# Altium schematic sheet XTAG4.SchDoc: xcore.ai Multi Channel Audio
size 584 x 408 mm; DocumentNumber: 7; Revision: 1V1; SheetNumber: 7; SheetTotal: 8
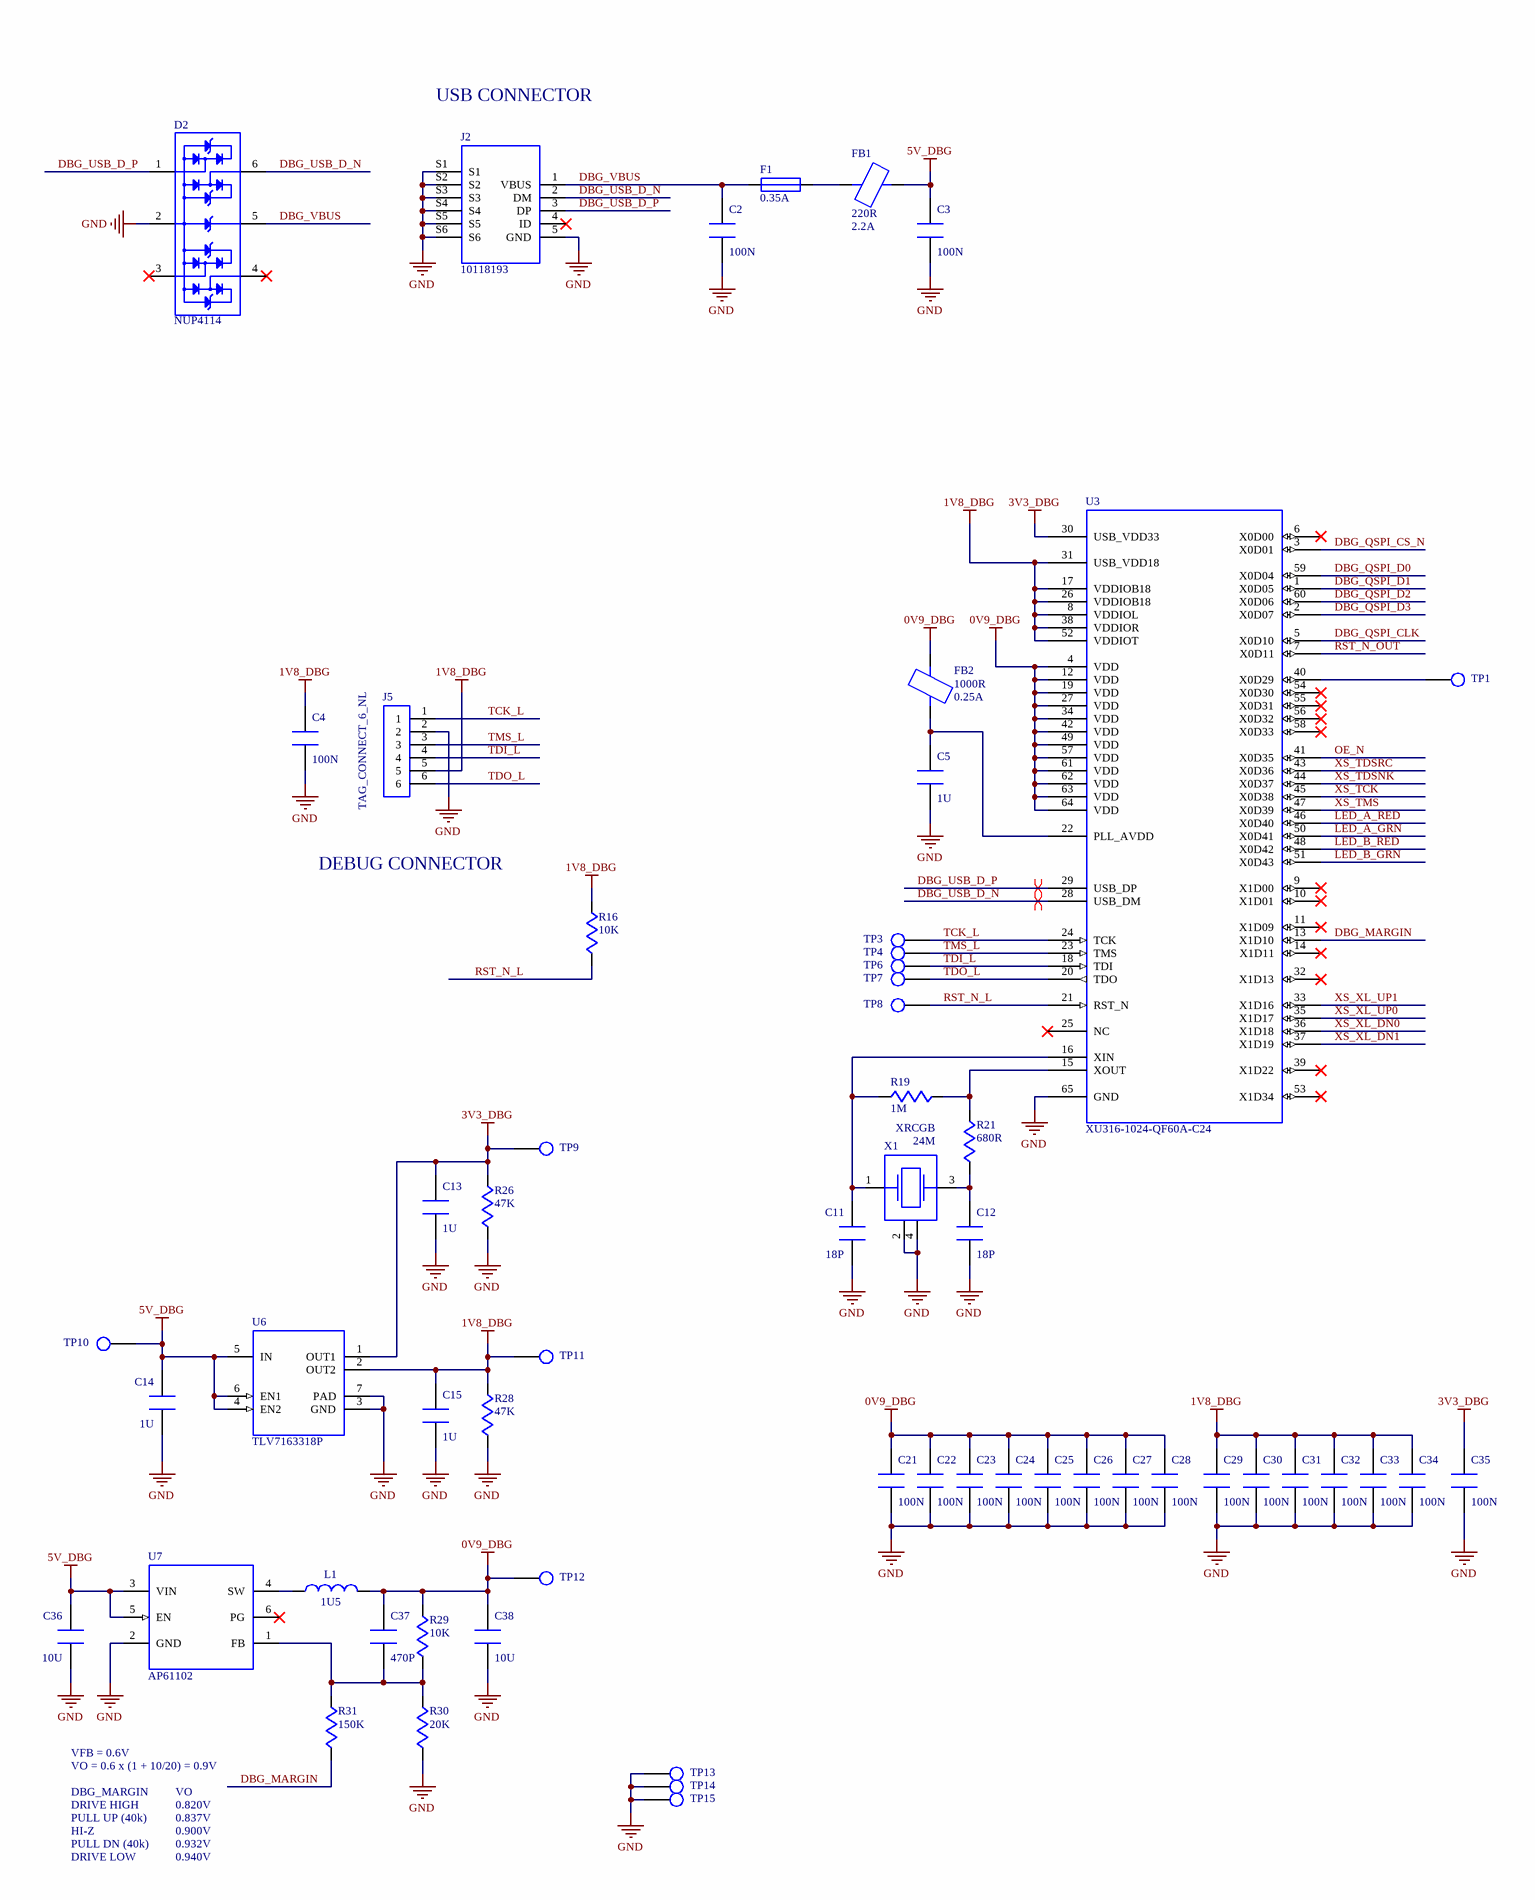
[diagram p0: XTAG4.SchDoc, left]
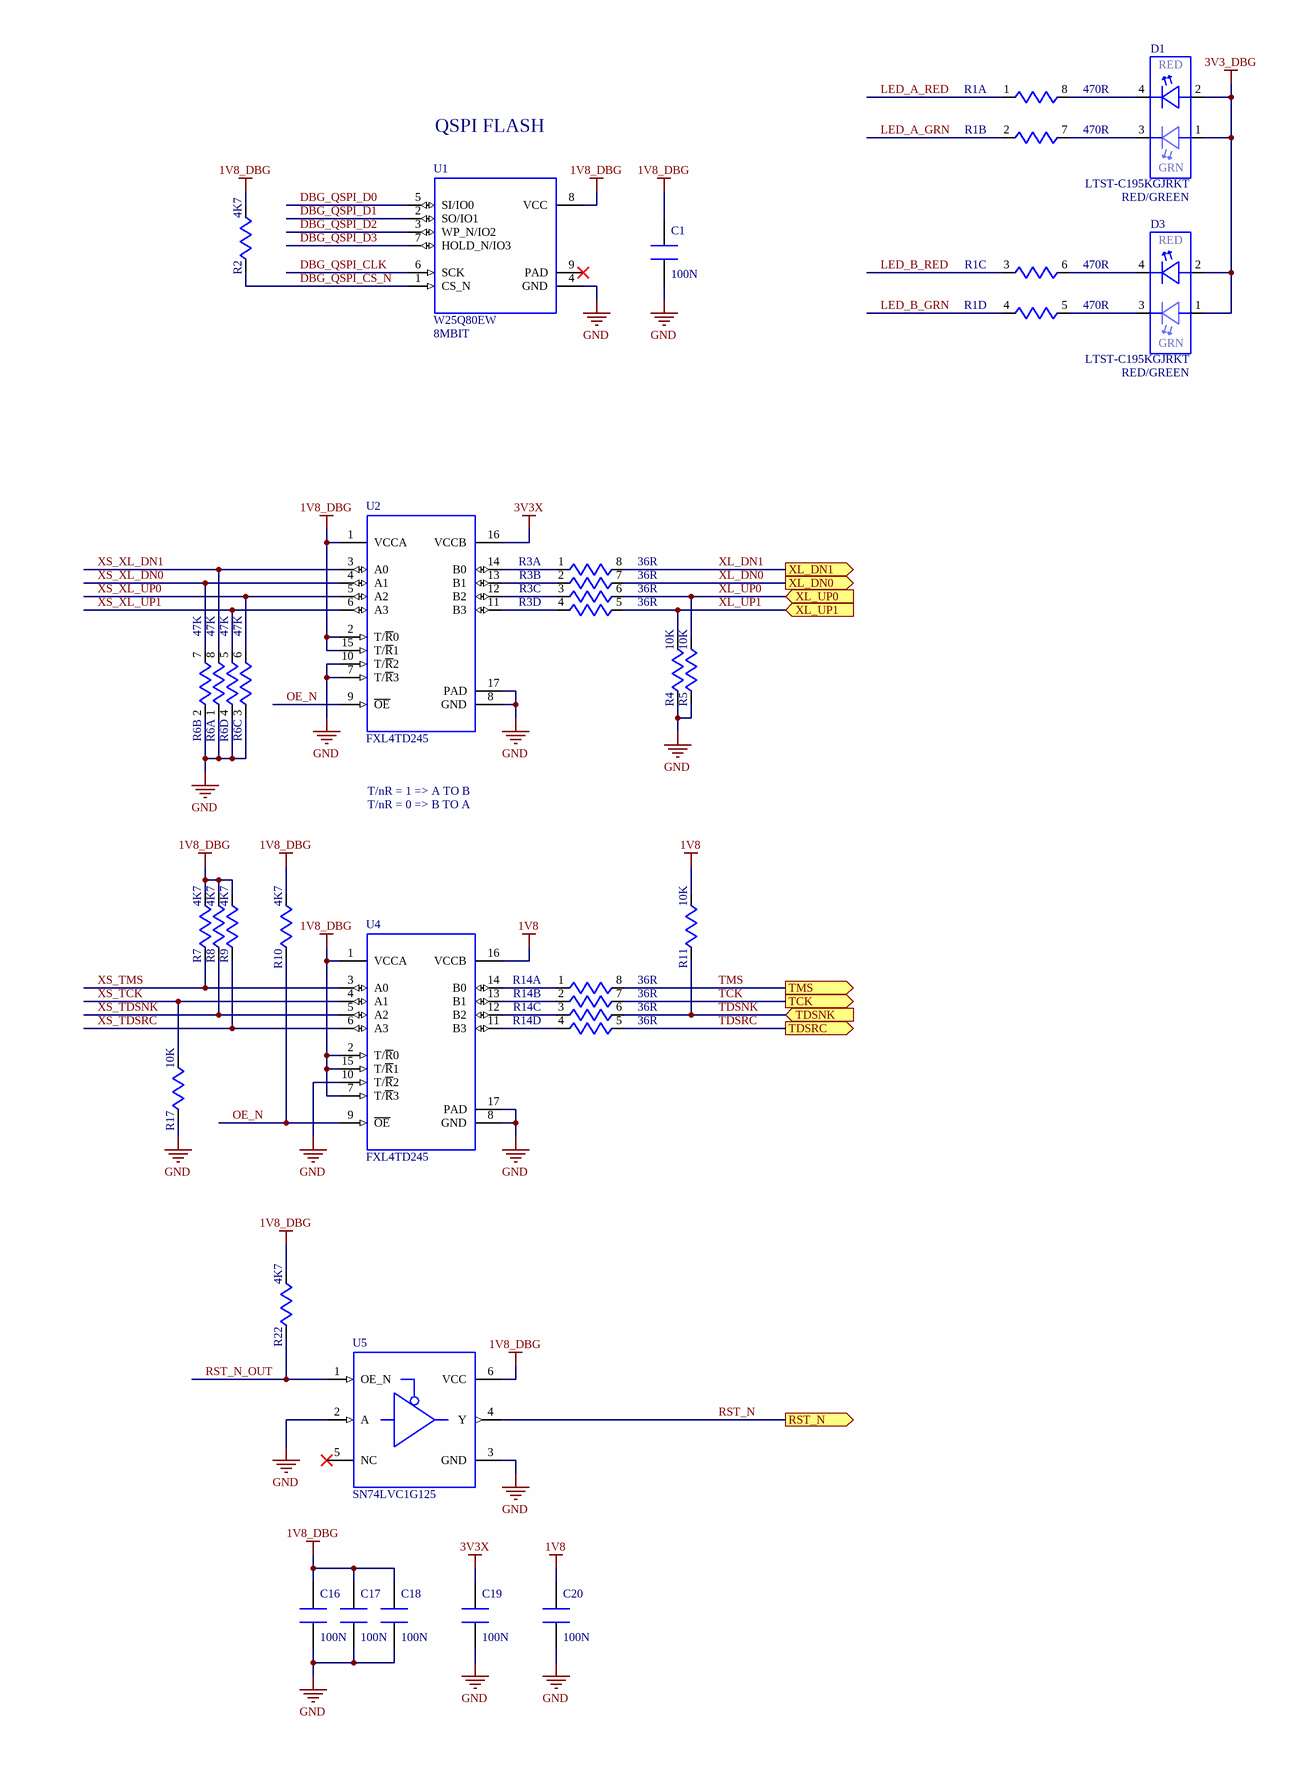
[diagram p1: XTAG4.SchDoc, right]

## Parts
C1  100N  [CAPC1005X55N]
C2  100N  [CAPC1005X55N]
C3  100N  [CAPC1005X55N]
C4  100N  [CAPC1005X55N]
C5  1U  [CAPC1005X55N]
C11  18P  [CAPC1005X55N]
C12  18P  [CAPC1005X55N]
C13  1U  [CAPC1005X55N]
C14  1U  [CAPC1005X55N]
C15  1U  [CAPC1005X55N]
C16  100N  [CAPC1005X55N]
C17  100N  [CAPC1005X55N]
C18  100N  [CAPC1005X55N]
C19  100N  [CAPC1005X55N]
C20  100N  [CAPC1005X55N]
C21  100N  [CAPC1005X55N]
C22  100N  [CAPC1005X55N]
C23  100N  [CAPC1005X55N]
C24  100N  [CAPC1005X55N]
C25  100N  [CAPC1005X55N]
C26  100N  [CAPC1005X55N]
C27  100N  [CAPC1005X55N]
C28  100N  [CAPC1005X55N]
C29  100N  [CAPC1005X55N]
C30  100N  [CAPC1005X55N]
C31  100N  [CAPC1005X55N]
C32  100N  [CAPC1005X55N]
C33  100N  [CAPC1005X55N]
C34  100N  [CAPC1005X55N]
C35  100N  [CAPC1005X55N]
C36  10U  [CAPC1608X90N]
C37  470P  [CAPC1005X55N]
C38  10U  [CAPC1608X90N]
D1  LTST-C195KGJRKT  Colour: RED/GREEN  [LED_LITEON_LTST_C195KGJRKT]
D2  NUP4114  [SOT65P210X110-6N]
D3  LTST-C195KGJRKT  Colour: RED/GREEN  [LED_LITEON_LTST_C195KGJRKT]
F1  0.35A  [FUSC215X135X75L40N]
FB1  220R  Rated Current: 2.2A  [INDC1608X95N]
FB2  1000R  Rated Current: 0.25A  [INDC1005X55N]
J2  10118193  [CON_FCI_10118193]
J5  TAG_CONNECT_6_NL  [CON_TAG_CONNECT_6_NOLEG]  (no BOM)
L1  1U5  [INDC2520X120N]
R1  470R  [RESCAXS50P200X100X55-8N]  (parts A,B,C,D of 4)
R2  4K7  [RESC1005X40N]
R3  36R  [RESCAXS50P200X100X55-8N]  (parts A,B,C,D of 4)
R4  10K  [RESC1005X40N]
R5  10K  [RESC1005X40N]
R6  47K  [RESCAXS50P200X100X55-8N]  (parts A,B,C,D of 4)
R7  4K7  [RESC1005X40N]
R8  4K7  [RESC1005X40N]
R9  4K7  [RESC1005X40N]
R10  4K7  [RESC1005X40N]
R11  10K  [RESC1005X40N]
R14  36R  [RESCAXS50P200X100X55-8N]  (parts A,B,C,D of 4)
R16  10K  [RESC1005X40N]
R17  10K  [RESC1005X40N]
R19  1M  [RESC1005X40N]
R21  680R  [RESC1005X40N]
R22  4K7  [RESC1005X40N]
R26  47K  [RESC1005X40N]
R28  47K  [RESC1005X40N]
R29  10K  [RESC1005X40N]
R30  20K  [RESC1005X40N]
R31  150K  [RESC1005X40N]
TP1  TESTPOINT  [TESTPOINT_SMD_1MM]  (value not drawn)  (no BOM)
TP3  TESTPOINT  [TESTPOINT_SMD_1.2MM]  (value not drawn)  (no BOM)
TP4  TESTPOINT  [TESTPOINT_SMD_1.2MM]  (value not drawn)  (no BOM)
TP6  TESTPOINT  [TESTPOINT_SMD_1.2MM]  (value not drawn)  (no BOM)
TP7  TESTPOINT  [TESTPOINT_SMD_1.2MM]  (value not drawn)  (no BOM)
TP8  TESTPOINT  [TESTPOINT_SMD_1.2MM]  (value not drawn)  (no BOM)
TP9  TESTPOINT  [TESTPOINT_SMD_1.2MM]  (value not drawn)  (no BOM)
TP10  TESTPOINT  [TESTPOINT_SMD_1.2MM]  (value not drawn)  (no BOM)
TP11  TESTPOINT  [TESTPOINT_SMD_1.2MM]  (value not drawn)  (no BOM)
TP12  TESTPOINT  [TESTPOINT_SMD_1.2MM]  (value not drawn)  (no BOM)
TP13  TESTPOINT  [TESTPOINT_SMD_1.2MM]  (value not drawn)  (no BOM)
TP14  TESTPOINT  [TESTPOINT_SMD_1.2MM]  (value not drawn)  (no BOM)
TP15  TESTPOINT  [TESTPOINT_SMD_1.2MM]  (value not drawn)  (no BOM)
U1  W25Q80EW  Memory Size: 8MBIT  [SON9P50_200X300X60L45X25T160X20N]
U2  FXL4TD245  [IC_NXP_DHVQFN16]
U3  XU316-1024-QF60A-C24  [IC_XMOS_PX_QFN60A_NEWPADDLE]
U4  FXL4TD245  [IC_NXP_DHVQFN16]
U5  SN74LVC1G125  [TI_R_PUSON_N6]
U6  TLV7163318P  [TI_S_PX2SON_N6]
U7  AP61102  [ICSOFL6P50_160X160X60L30X21N]
X1  XRCGB  FREQUENCY: 24M  [OSCCC200X160X70N]

## Ports
RST_N (out), TCK (out), TDSNK (in), TDSRC (out), TMS (out), XL_DN0 (out), XL_DN1 (out), XL_UP0 (in), XL_UP1 (in)

## Nets
0V9_DBG: C21.1 C22.1 C23.1 C24.1 C25.1 C26.1 C27.1 C28.1 C37.1 C38.1 FB2.2 L1.2 R29.2 TP12.1 U3.4(VDD) U3.12(VDD) U3.19(VDD) U3.27(VDD) U3.34(VDD) U3.42(VDD) U3.49(VDD) U3.57(VDD) U3.61(VDD) U3.62(VDD) U3.63(VDD) U3.64(VDD)
1V8: C20.1 R11.2 U4.16(VCCB)
1V8_DBG: C1.1 C4.1 C15.1 C16.1 C17.1 C18.1 C29.1 C30.1 C31.1 C32.1 C33.1 C34.1 J5.5 R2.2 R7.2 R8.2 R9.2 R10.2 R16.2 R22.2 R28.2 TP11.1 U1.8(VCC) U2.1(VCCA) U2.2(T/~{R}0) U2.15(T/~{R}1) U3.8(VDDIOL) U3.17(VDDIOB18) U3.26(VDDIOB18) U3.31(USB_VDD18) U3.38(VDDIOR) U3.52(VDDIOT) U4.1(VCCA) U4.2(T/~{R}0) U4.7(T/~{R}3) U4.15(T/~{R}1) U5.6(VCC) U6.2(OUT2)
3V3_DBG: C13.1 C35.1 D1.1(GRN_A) D1.2(RED_A) D3.1(GRN_A) D3.2(RED_A) R26.2 TP9.1 U3.30(USB_VDD33) U6.1(OUT1)
3V3X: C19.1 U2.16(VCCB)
5V_DBG: C3.1 C14.1 C36.1 FB1.2 TP10.1 U6.4(EN2) U6.5(IN) U6.6(EN1) U7.3(VIN) U7.5(EN)
GND: C1.2 C2.2 C3.2 C4.2 C5.2 C11.2 C12.2 C13.2 C14.2 C15.2 C16.2 C17.2 C18.2 C19.2 C20.2 C21.2 C22.2 C23.2 C24.2 C25.2 C26.2 C27.2 C28.2 C29.2 C30.2 C31.2 C32.2 C33.2 C34.2 C35.2 C36.2 C38.2 D2.2 J2.5(GND) J2.S1 J2.S2 J2.S3 J2.S4 J2.S5 J2.S6 J5.2 R4.1 R5.1 R6.1 R6.2 R6.3 R6.4 R17.1 R26.1 R28.1 R30.1 TP13.1 TP14.1 TP15.1 U1.4(GND) U2.7(T/~{R}3) U2.8(GND) U2.10(T/~{R}2) U2.17(PAD) U3.65(GND) U4.8(GND) U4.10(T/~{R}2) U4.17(PAD) U5.2(A) U5.3(GND) U6.3(GND) U6.7(PAD) U7.2(GND) X1.2(CASE_2) X1.4(CASE_4)
DBG_MARGIN: R31.1 U3.13(X1D10)
DBG_QSPI_CLK: U1.6(SCK) U3.5(X0D10)
DBG_QSPI_CS_N: R2.1 U1.1(CS_N) U3.3(X0D01)
DBG_QSPI_D0: U1.5(SI/IO0) U3.59(X0D04)
DBG_QSPI_D1: U1.2(SO/IO1) U3.1(X0D05)
DBG_QSPI_D2: U1.3(WP_N/IO2) U3.60(X0D06)
DBG_QSPI_D3: U1.7(HOLD_N/IO3) U3.2(X0D07)
DBG_USB_D_N: D2.6 J2.2(DM) U3.28(USB_DM)
DBG_USB_D_P: D2.1 J2.3(DP) U3.29(USB_DP)
DBG_VBUS: C2.1 D2.5 F1.1(T1) J2.1(VBUS)
LED_A_GRN: R1.2 U3.50(X0D41)
LED_A_RED: R1.1 U3.46(X0D40)
LED_B_GRN: R1.4 U3.51(X0D43)
LED_B_RED: R1.3 U3.48(X0D42)
OE_N: R10.1 U2.9(~{OE}) U3.41(X0D35) U4.9(~{OE})
RST_N: U5.4(Y) ; port RST_N
RST_N_L: R16.1 TP8.1 U3.21(RST_N)
RST_N_OUT: R22.1 U3.7(X0D11) U5.1(OE_N)
TCK: R14.7 ; port TCK
TCK_L: J5.1 TP3.1 U3.24(TCK)
TDI_L: J5.4 TP6.1 U3.18(TDI)
TDO_L: J5.6 TP7.1 U3.20(TDO)
TDSNK: R11.1 R14.6 ; port TDSNK
TDSRC: R14.5 ; port TDSRC
TMS: R14.8 ; port TMS
TMS_L: J5.3 TP4.1 U3.23(TMS)
XL_DN0: R3.7 ; port XL_DN0
XL_DN1: R3.8 ; port XL_DN1
XL_UP0: R3.6 R5.2 ; port XL_UP0
XL_UP1: R3.5 R4.2 ; port XL_UP1
XS_TCK: R17.2 U3.45(X0D38) U4.4(A1)
XS_TDSNK: R8.1 U3.44(X0D37) U4.5(A2)
XS_TDSRC: R9.1 U3.43(X0D36) U4.6(A3)
XS_TMS: R7.1 U3.47(X0D39) U4.3(A0)
XS_XL_DN0: R6.7 U2.4(A1) U3.36(X1D18)
XS_XL_DN1: R6.8 U2.3(A0) U3.37(X1D19)
XS_XL_UP0: R6.6 U2.5(A2) U3.35(X1D17)
XS_XL_UP1: R6.5 U2.6(A3) U3.33(X1D16)
NetC5_1: C5.1 FB2.1 U3.22(PLL_AVDD)
NetC11_1: C11.1 R19.1 U3.16(XIN) X1.1(A)
NetC12_1: C12.1 R21.1 X1.3(B)
NetC37_2: C37.2 R29.1 R30.2 R31.2 U7.1(FB)
NetD1_3: D1.3(GRN_K) R1.7
NetD1_4: D1.4(RED_K) R1.8
NetD3_3: D3.3(GRN_K) R1.5
NetD3_4: D3.4(RED_K) R1.6
NetF1_2: F1.2(T2) FB1.1
NetL1_1: L1.1 U7.4(SW)
NetR3_1: R3.1 U2.14(B0)
NetR3_2: R3.2 U2.13(B1)
NetR3_3: R3.3 U2.12(B2)
NetR3_4: R3.4 U2.11(B3)
NetR14_1: R14.1 U4.14(B0)
NetR14_2: R14.2 U4.13(B1)
NetR14_3: R14.3 U4.12(B2)
NetR14_4: R14.4 U4.11(B3)
NetR19_2: R19.2 R21.2 U3.15(XOUT)
NetTP1_1: TP1.1 U3.40(X0D29)

Not connected (* = marked no-connect by the designer): D2 3* 4*; J2 4(ID)*; U1 9(PAD)*; U3 6(X0D00)* 9(X1D00)* 10(X1D01)* 11(X1D09)* 14(X1D11)* 25(NC)* 32(X1D13)* 39(X1D22)* 53(X1D34)* 54(X0D30)* 55(X0D31)* 56(X0D32)* 58(X0D33)*; U5 5(NC)*; U7 6(PG)*

## Layout directives
differential pair; differential pair class USB: DBG_USB_D_N, DBG_USB_D_P

## Notes on the sheet
- USB CONNECTOR
- QSPI FLASH
- T/nR = 1 => A TO B
- T/nR = 0 => B TO A
- DEBUG CONNECTOR
- VFB = 0.6V
- VO = 0.6 x (1 + 10/20) = 0.9V
- DBG_MARGIN
- VO
- HI-Z
- PULL DN (40k)
- PULL UP (40k)
- DRIVE LOW
- DRIVE HIGH
- 0.900V
- 0.932V
- 0.837V
- 0.940V
- 0.820V
- Project Name
- Build
- Sheet Name
- Rev
- Date
- Sheet
- of
- (in symbol GEN-17-0007) RED; GRN

## Library data of the parts
C1-C4 C16-C35 = STD-06-0048: CHIP CAPACITOR, CERAMIC, 100NF, 16V, 10%, X7R, 0402; Manufacturer: Yageo; Manufacturer Part Number: CC0402KRX7R7BB104; Approx Volume Cost ($): 0.003; VALUE: 100N; Part Number: STD-06-0048; Dielectric: X7R; Rated Voltage: 16V; Tolerance: 10%
C5 C13-C15 = STD-06-0140: CHIP CAPACITOR, CERAMIC, 1.0UF, 16V, 10%, X5R, 0402; Manufacturer: Murata; Manufacturer Part Number: GRM155R61C105MA12D; Tolerance: 20%; Approx Volume Cost ($): 0.011; VALUE: 1U; Part Number: STD-06-0140; Dielectric: X5R; Rated Voltage: 16V
C11 C12 = STD-06-0016: CHIP CAPACITOR, CERAMIC, 18PF, 50V, 5%, NP0, 0402; Manufacturer: Yageo; Manufacturer Part Number: CC0402JRNPO9BN180; Approx Volume Cost ($): 0.003; VALUE: 18P; Part Number: STD-06-0016; Dielectric: NP0; Rated Voltage: 50V; Tolerance: 5%
C36 C38 = GEN-03-0043: CHIP CAPACITOR, CERAMIC, 10UF, 10V, 20%, X5R, 0603; Manufacturer: Murata; Manufacturer Part Number: GRM188R61A106ME69; Approx Volume Cost ($): 0.03; VALUE: 10U; Part Number: GEN-03-0043; Dielectric: X5R; Rated Voltage: 10V; Tolerance: 20%
C37 = STD-06-0034: CHIP CAPACITOR, CERAMIC, 470PF, 50V, 10%, X7R, 0402; Manufacturer: Yageo; Manufacturer Part Number: CC0402KRX7R9BB471; Approx Volume Cost ($): 0.002; VALUE: 470P; Part Number: STD-06-0034; Dielectric: X7R; Rated Voltage: 50V; Tolerance: 10%; Web Search Link: http://www.google.com/search?q=CC0402KRX7R9BB471
D1 D3 = GEN-17-0007: LED, Top View, RED/GREEN, SMD, 0606; Manufacturer: Lite-On; Approx Volume Cost ($): 0.1; VALUE: LTST-C195KGJRKT; Part Number: GEN-17-0007; Manufacturer Part Number: LTST-C195KGJRKT
D2 = GEN-16-0048: ESD Protection Diode Array, 0.6pF, SC-70-6 (SC-88); Manufacturer: ON Semiconductor; Manufacturer Part Number: NUP4114UCLW1T2G; Approx Volume Cost ($): 0.1; VALUE: NUP4114; Part Number: GEN-16-0048; Web Search Link: http://www.google.com/search?q=NUP4114UCLW1T2G
F1 = GEN-21-0009: PTC Fuse, SMD, 0.35A hold, 0.75A trip, 6V, 0805; Manufacturer: Bel Fuse; Manufacturer Part Number: 0ZCK0035FF2G; Max Resistance (R1max): 1.2R; Approx Volume Cost ($): 0.07; VALUE: 0.35A; Part Number: GEN-21-0009; Hold Current: 0.35A; Trip Current: 0.75A; Max Voltage: 6V; Link: https://www.google.com/search?q=Bel Fuse 0ZCK0035FF2G
FB1 = GEN-04-0018: Ferrite Bead, 220R AT 100MHz, For Power Lines, AEC-Q200, 0603, 2.2A; Manufacturer: Murata; Manufacturer Part Number: BLM18KG221BH1; Max DCR: 0.05R; Approx Volume Cost ($): 0.022; VALUE: 220R; Part Number: GEN-04-0018; Web Search Link: http://www.google.com/search?q=BLM18KG221BH1
FB2 = GEN-04-0019: Ferrite Bead, 1000R AT 100MHz, For Signal Lines, 0402, 0.25A; Manufacturer: Murata; Manufacturer Part Number: BLM15HD102SN1; Max DCR: 1.25R; Approx Volume Cost ($): 0.018; VALUE: 1000R; Part Number: GEN-04-0019; Web Search Link: http://www.google.com/search?q=BLM15HD102SN1
J2 = GEN-01-0020: USB Micro B Receptacle, Right Angle, SMD w/2 DIP Legs; Manufacturer: FCI; Manufacturer Part Number: 10118193-0001LF; Approx Volume Cost ($): 0.19; VALUE: 10118193; Part Number: GEN-01-0020
J5 = GEN-24-0021: Connectorless Tag Connect Footprint, 6 pin, No Legs; Manufacturer: NA; VALUE: TAG_CONNECT_6_NL; Part Number: GEN-24-0021; Manufacturer Part Number: NA; Approx Volume Cost ($): NA
L1 = GEN-05-0025: Power Inductor, 1.5uH, 2.6A, 65mR DCR, 2.5x2.0x1.2mm, SMD; Manufacturer: Taiyo Yuden; Manufacturer Part Number: MAMK2520H1R5M; Tolerance: 20%; Max DC Resistance: 0.065R; Rated Current (Saturation): 3.3A; Approx Volume Cost ($): 0.096; VALUE: 1U5; Part Number: GEN-05-0025; Rated Current (Temp Rise): 2.6A; Web Search Link: http://www.google.com/search?q=MAMK2520H1R5M
R1 = STD-09-0014: CHIP RESISTOR ARRAY, 4 ELEMENT, 470 OHM, 63mW, 5%, 0804; Manufacturer: Yageo; Manufacturer Part Number: YC124-JR-07470RL; Max Voltage: 25V; Temperature Coefficient: ±200ppm/°C; Approx Volume Cost ($): 0.007; VALUE: 470R; Part Number: STD-09-0014; Tolerance: 5%; Max Power: 63mW
R2 R7-R10 R22 = STD-01-0072: CHIP RESISTOR, 4.7K OHM, 63mW, 1%, 0402; Manufacturer: Yageo; Manufacturer Part Number: RC0402FR-074K7L; Max Voltage: 50V; Temperature Coefficient: ±100ppm/°C; Approx Volume Cost ($): 0.002; VALUE: 4K7; Part Number: STD-01-0072; Tolerance: 1%; Max Power: 63mW
R3 R14 = GEN-02-0026: CHIP RESISTOR ARRAY, 4 ELEMENT, 36 OHM, 63mW, 5%, 0804; Manufacturer: Panasonic; Manufacturer Part Number: EXB-28V360JX; Max Voltage: 50V; Temperature Coefficient: ±200ppm/°C; Approx Volume Cost ($): 0.008; VALUE: 36R; Part Number: GEN-02-0026; Tolerance: 5%; Max Power: 63mW
R4 R5 R11 R16 R17 R29 = STD-01-0080: CHIP RESISTOR, 10K OHM, 63mW, 1%, 0402; Manufacturer: Yageo; Manufacturer Part Number: RC0402FR-0710KL; Max Voltage: 50V; Temperature Coefficient: ±100ppm/°C; Approx Volume Cost ($): 0.002; VALUE: 10K; Part Number: STD-01-0080; Tolerance: 1%; Max Power: 63mW
R6 = STD-09-0026: CHIP RESISTOR ARRAY, 4 ELEMENT, 47K OHM, 63mW, 5%, 0804; Manufacturer: Yageo; Manufacturer Part Number: YC124-JR-0747KL; Max Voltage: 25V; Temperature Coefficient: ±200ppm/°C; Approx Volume Cost ($): 0.007; VALUE: 47K; Part Number: STD-09-0026; Tolerance: 5%; Max Power: 63mW
R19 = STD-01-0128: CHIP RESISTOR, 1.0M OHM, 63mW, 5%, 0402; Manufacturer: Yageo; Manufacturer Part Number: RC0402JR-071ML; Max Voltage: 50V; Temperature Coefficient: ±100ppm/°C; Approx Volume Cost ($): 0.002; VALUE: 1M; Part Number: STD-01-0128; Tolerance: 5%; Max Power: 63mW
R21 = STD-01-0052: CHIP RESISTOR, 680 OHM, 63mW, 1%, 0402; Manufacturer: Yageo; Manufacturer Part Number: RC0402FR-07680RL; Max Voltage: 50V; Temperature Coefficient: ±100ppm/°C; Approx Volume Cost ($): 0.002; VALUE: 680R; Part Number: STD-01-0052; Tolerance: 1%; Max Power: 63mW
R26 R28 = STD-01-0096: CHIP RESISTOR, 47K OHM, 63mW, 1%, 0402; Manufacturer: Yageo; Manufacturer Part Number: RC0402FR-0747KL; Max Voltage: 50V; Temperature Coefficient: ±100ppm/°C; Approx Volume Cost ($): 0.002; VALUE: 47K; Part Number: STD-01-0096; Tolerance: 1%; Max Power: 63mW
R30 = STD-01-0087: CHIP RESISTOR, 20K OHM, 63mW, 1%, 0402; Manufacturer: Yageo; Manufacturer Part Number: RC0402FR-0720KL; Max Voltage: 50V; Temperature Coefficient: ±100ppm/°C; Approx Volume Cost ($): 0.002; VALUE: 20K; Part Number: STD-01-0087; Tolerance: 1%; Max Power: 63mW
R31 = STD-01-0108: CHIP RESISTOR, 150K OHM, 63mW, 1%, 0402; Manufacturer: Yageo; Manufacturer Part Number: RC0402FR-07150KL; Max Voltage: 50V; Temperature Coefficient: ±100ppm/°C; Approx Volume Cost ($): 0.002; VALUE: 150K; Part Number: STD-01-0108; Tolerance: 1%; Max Power: 63mW; Web Search Link: http://www.google.com/search?q=RC0402FR-07150KL
TP1 = GEN-24-0003: Testpoint, SMD, 1mm; Manufacturer: NA; VALUE: TESTPOINT; Part Number: GEN-24-0003; Manufacturer Part Number: NA; Approx Volume Cost ($): NA
TP3 TP4 TP6-TP15 = GEN-24-0014: Testpoint, SMD, 1.2mm; Manufacturer: NA; VALUE: TESTPOINT; Part Number: GEN-24-0014; Manufacturer Part Number: NA; Approx Volume Cost ($): NA
U1 = GEN-12-0023: Memory, Flash, SPI, Multi-IO, 8Mb (4Kx256), 1.65V to 1.95V, USON-8 (2x3mm); Manufacturer: Winbond; Manufacturer Part Number: W25Q80EWUXIE; Approx Volume Cost ($): 0.38; VALUE: W25Q80EW; Part Number: GEN-12-0023
U2 U4 = GEN-11-0017: Configurable Dual-Voltage Supply Translator, 4 bit, DQFN16; Manufacturer: Fairchild; Manufacturer Part Number: FXL4TD245BQX; Approx Volume Cost ($): 0.5; VALUE: FXL4TD245; Part Number: GEN-11-0017; Web Search Link: http://www.google.com/search?q=FXL4TD245BQX
U3 = GEN-08-0033: Processor, xcore.ai, 2400MIPS, 1.8V VDDIO, 60QFN; Manufacturer: XMOS; Approx Volume Cost ($): 1; VALUE: XU316-1024-QF60A-C24; Part Number: GEN-08-0033; Manufacturer Part Number: XU316-1024-QF60A-C24; Web Search Link: http://www.google.com/search?q=XU316-1024-QF60A
U5 = GEN-11-0049: Single Buffer with 3-State Output, LVC Series, SON6; Manufacturer: Texas Instruments; Manufacturer Part Number: SN74LVC1G125DRYR; Approx Volume Cost ($): 0.14; VALUE: SN74LVC1G125; Part Number: GEN-11-0049; Web Search Link: http://www.google.com/search?q=SN74LVC1G125DRYR
U6 = GEN-14-0057: Voltage Regulator, Dual, 3.3V/1.8V, 150mA, Low Iq, Low Dropout, X2SON-6; Manufacturer: Texas Instruments; Manufacturer Part Number: TLV7163318PDPQR; Op Temp Range: TJ = -40 to 125; Approx Volume Cost ($): 0.13; VALUE: TLV7163318P; Part Number: GEN-14-0057
U7 = GEN-14-0064: DC-DC Synchronous Buck Converter, Adjustable, PFM/PWM, Power Good, 2.2MHz, 1A, SOT563; Manufacturer: Diodes Incorporated; Manufacturer Part Number: AP61102Z6-7; Op Temp Range: TJ = -40 to 125; Approx Volume Cost ($): 0.11; VALUE: AP61102; Part Number: GEN-14-0064; Web Search Link: http://www.google.com/search?q=AP61102Z6-7
X1 = GEN-15-0038: Crystal, 24MHz, Freq Tol. ±8ppm, Freq Stab. ±12ppm, CL 10pF, Max ESR 70 Ohm, 2.0x1.6mm SMD; Manufacturer: Murata; Manufacturer Part Number: XRCGB24M000FFS1CR0; Approx Volume Cost ($): 0.27; VALUE: XRCGB; Part Number: GEN-15-0038; Web Search Link: http://www.google.com/search?q=XRCGB24M000FFS1CR0